# Altium schematic sheet RS485.SchDoc
size A
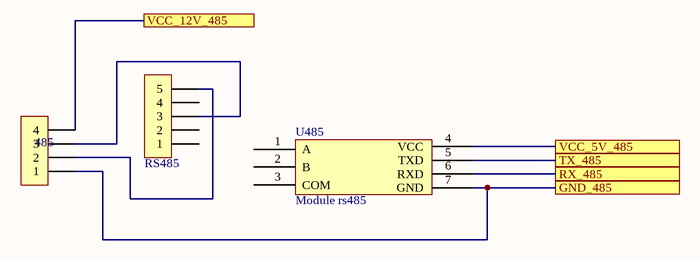
[diagram p0: RS485.SchDoc]

## Parts
485  Header 4P 2.54 Duc Thang  [XH2.54M-4]  (value not drawn)
RS485  Header 5P 2.54 Duc Thang  [XH2.54M-5]  (value not drawn)
U485  Module rs485  [RS485]

## Ports
GND_485, RX_485, TX_485, VCC_5V_485, VCC_12V_485

## Nets
GND_485: 485.1 U485.7(GND) ; port GND_485
RX_485: U485.6(RXD) ; port RX_485
TX_485: U485.5(TXD) ; port TX_485
VCC_5V_485: U485.4(VCC) ; port VCC_5V_485
VCC_12V_485: 485.4 ; port VCC_12V_485
Net485_2: 485.2 RS485.5
Net485_3: 485.3 RS485.3

Not connected (* = marked no-connect by the designer): RS485 1 2 4; U485 1(A) 2(B) 3(COM)

## Library data of the parts
485 = Header 4P 2.54 Duc Thang: Cắm; Ten_Linh_Kien: Header 4P XH2.54-4P Đực Thẳng; Don_Vi: Con; Ma_Hang: MH001285; Chung_Loai: Cắm
RS485 = Header 5P 2.54 Duc Thang: Cắm; Ten_Linh_Kien: Header 5P XH2.54-5P Đực Thẳng; Don_Vi: Con; Ma_Hang: MH001298; Chung_Loai: Cắm